# Altium schematic sheet cc3d_addons.SchDoc
size A
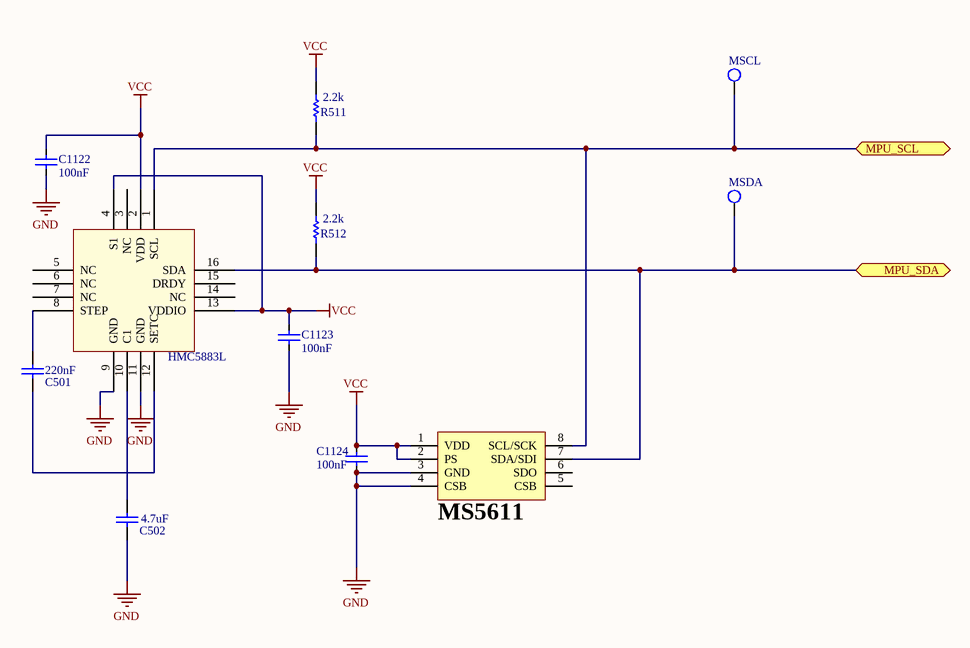
[diagram p0: cc3d_addons.SchDoc]

## Parts
C501  value 220nF  [CAPC0603(1608)100_M]  (hidden comment: CAP 220nF 6.3V 0603(1608))
C502  value 4.7uF  [CAPC0402(1005)60_L]  (hidden comment: CAP 4.7uF 6.3V 0402(1005))
C1122  value 100nF  [CAP603L]  (hidden comment: Cap603)
C1123  value 100nF  [CAP603L]  (hidden comment: Cap603)
C1124  value 100nF  [CAP603L]  (hidden comment: Cap603)
MG1  HMC5883L  [HMC5883L]
MS1  MS5611  [MS5611]
MSCL  TestPoint  [Tespoint_Keystone]  (value not drawn)
MSDA  Testpoint  [Tespoint_Keystone]  (value not drawn)
R511  value 2.2k  [RESC0603(1608)_L]  (hidden comment: 2K2 1% 0603(1608))
R512  value 2.2k  [RESC0603(1608)_L]  (hidden comment: 2K2 1% 0603(1608))

## Ports
MPU_SCL (bidir), MPU_SDA (bidir)

## Nets
GND: C502.1 C1122.1 C1123.1 C1124.1 MG1.9(GND) MG1.11(GND) MS1.3(GND) MS1.4(CSB)
VCC: C1122.2 C1123.2 C1124.2 MG1.2(VDD) MG1.4(S1) MG1.13(VDDIO) MS1.1(VDD) MS1.2(PS) R511.2 R512.2
MPU_SCL: MG1.1(SCL) MS1.8(SCL/SCK) MSCL.1(TP) R511.1 ; port MPU_SCL
MPU_SDA: MG1.16(SDA) MS1.7(SDA/SDI) MSDA.1(TP) R512.1 ; port MPU_SDA
NetC501_1: C501.1 MG1.12(SETC)
NetC501_2: C501.2 MG1.8(STEP)
NetC502_2: C502.2 MG1.10(C1)

Not connected (* = marked no-connect by the designer): MG1 3(NC) 5(NC) 6(NC) 7(NC) 14(NC) 15(DRDY); MS1 5(CSB) 6(SDO)

## Library data of the parts
C501 = CMP-1035-02636-1: CAP 220nF 6.3V ±10% 0603 (1608 Metric) Thickness 1mm SMD; Case-EIA: 0603; Case-Metric: 1608; Technology: SMT; Max Thickness: 1 mm; Rated Voltage: 6.3 V; Tolerance: ±10%; Supplier 1: Digi-Key; Supplier Part Number 1: 399-9046-1-ND
C502 = CMP-1034-02136-1: CAP 4.7uF 6.3V ±10% 0402 (1005 Metric) Thickness 0.6mm SMD; Case-EIA: 0402; Case-Metric: 1005; Tolerance: ±10%; Technology: SMT; Max Thickness: 0.6 mm; Rated Voltage: 6.3 V; Supplier 1: Digi-Key; Supplier Part Number 1: 445-5947-1-ND
C1122-C1124 = Cap603: Capacitor SMD; Published: 1-Nov-2010; LatestRevisionDate: 1-Nov-2010; LatestRevisionNote: Released OpenPilot Lib; PackageReference: 0603 (1608 Metric); Publisher: The OpenPilot Project; Supplier 1: Digi-Key; Supplier Part Number 1: 399-5089-1-ND
MS1 = MS5611: Sensor
R511 R512 = CMP-1012-00546-1: 2K2 0.1W 1% 0603 (1608 Metric)  SMD; Case-EIA: 0603; Case-Metric: 1608; Tolerance: 1 %; Power: 0.1 W; Technology: SMT; Supplier 1: Digi-Key; Supplier Part Number 1: 311-2.20KHRCT-ND
MG1 = HMC5883L: Supplier 1: Digi-Key; Supplier Part Number 1: 342-1082-1-ND
MSCL MSDA = TestPoint: Supplier 1: Digi-Key; Supplier Part Number 1: 5000K-ND